# EAGLE design EndCap_Board (EAGLE 9.6.2)
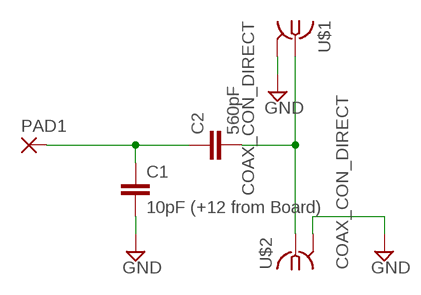
[diagram p0: schematic, sheet 1]

## Parts
C1  10pF (+12 from Board)  C-EUC1210  [C1210]
C2  560pF  C-EUC1210  [C1210]
PAD1  SMD5  [SMD2,54-5,08]
U$1  COAX_CON_DIRECT  [COAX.141]
U$2  COAX_CON_DIRECT  [COAX.141]

## Nets
GND: C1.2 U$1.P$2(GND) U$2.P$2(GND)
N$1: C1.1 C2.1 PAD1.1(P)
N$2: C2.2 U$1.P$1 U$2.P$1

## Library data of the parts
C1 C2 = rcl:C-EU: CAPACITOR, European symbol; SPICEPREFIX: C
PAD1 = wirepad:SMD5: SMD PAD
U$1 U$2 = Orzada:COAX_CON_DIRECT: Direct Coax to Bord Top

## Board
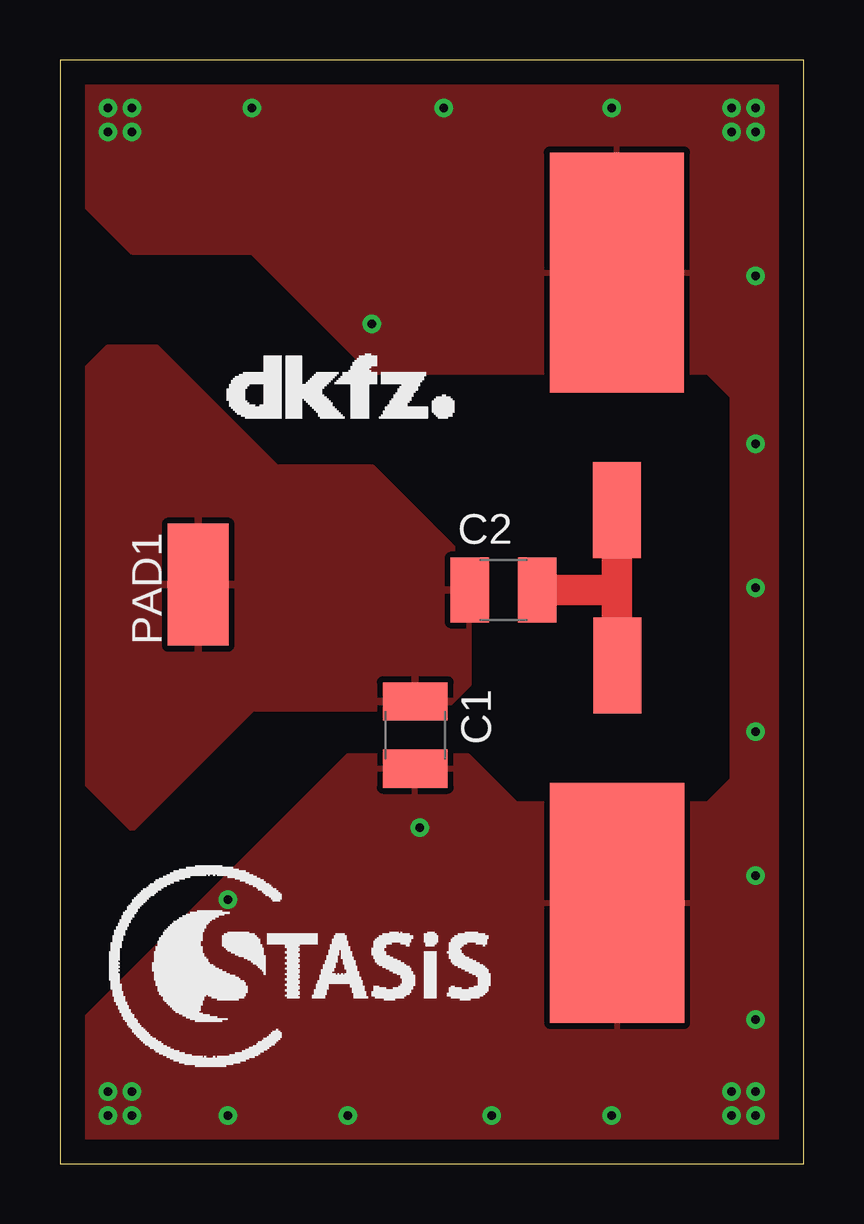
[diagram p1: board, top side]
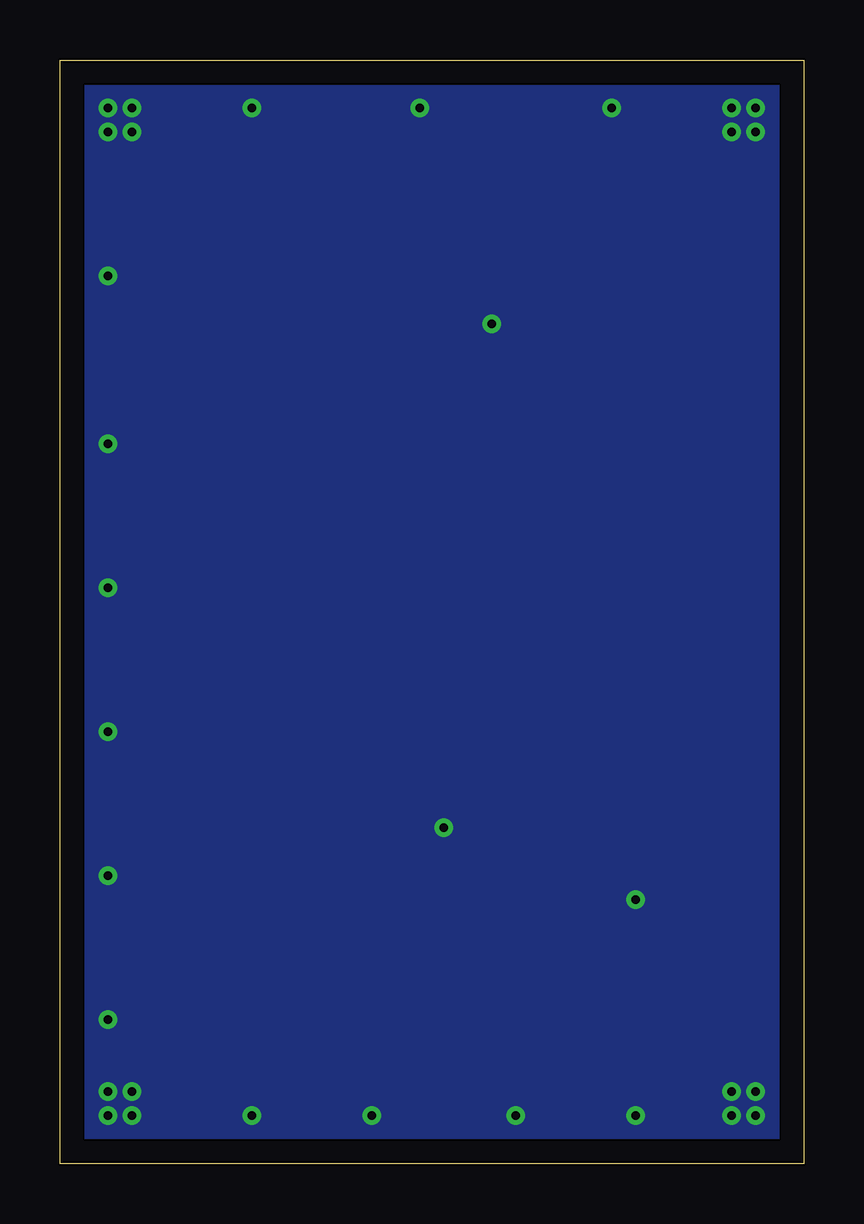
[diagram p2: board, bottom side, seen from below]

Size 31 x 46 mm. Coordinates in mm from the lower left corner, seen from the top.
Outline: 0,0 31,0 31,46 0,46 0,0
Copper layers (1*16): Top 0.035mm / dielectric 0.5mm / Bottom 0.035mm
Design rules "default *": minimum track width 6mil, minimum drill 0.35mm, track to track 6mil, track to pad 6mil, pad to pad 6mil, via to via 6mil, smd to smd 6mil, copper to edge 40mil, drill to drill 6mil, minimum pad ring 10mil, minimum via ring 8mil, stop-mask expansion 4mil, vias tented up to drill 0mil, thermal gap 10mil

### Footprints (pad centres in the part's own frame; a part is rotated, then mirrored left to right if it is on the bottom)
C1210 = smd 1.6 x 2.7: 1 -1.4,0; 2 1.4,0
SMD2,54-5,08 = smd 2.54 x 5.08: 1 0,0
COAX.141 = smd 4 x 2: P$1 -3.364,0 | smd 10 x 5.588: P$2 6.546,0

### Placement (x,y rotation side)
C1  14.81,17.86 270 top
C2  18.49,23.91 0 top
PAD1  5.76,24.13 0 top
U$1  23.23,17.4 270 top
U$2  23.22,30.6 90 top
U$3  [LOGO_STASIS]  11,8 0 top
U$4  [LOGO_DKFZ]  7,31 0 top

### Tracks (layer width: path | path; a pad name or v marks a point on that pad's centre or on a via)
GND  (via drill 0.35)
  other vias: 2,2 3,2 3,3 2,3 29,2 29,3 28,3 28,2 29,44 28,44 28,43 29,43 2,44 2,43 3,43 3,44 29,37 29,30 29,24 29,18 29,12 29,6 23,2 18,2 12,2 7,2 8,44 16,44 23,44 13,35 7,11 15,14
  pour Top: 17,17 12,17 1,6 1,1 30,1 30,45 1,45 1,40 3,38 8,38 13,33 27,33 28,32 28,16 27,15 19,15
  pour Bottom: 1,45 1,1 30,1 30,45
N$1
  pour Top: 1,33 1,16 3,14 8,19 16,19 17,20 17,25 13,29 9,29 4,34 2,34
N$2
  Top 1.27: C2.2 22.91,23.91 23.22,24.22 | 23.22,24.22 U$2.P$1 | U$1.P$1 23.22,20.77 23.22,24.22